# Altium project Anemoia-ESP32-SMD.PrjPcb (part 1 of 3)
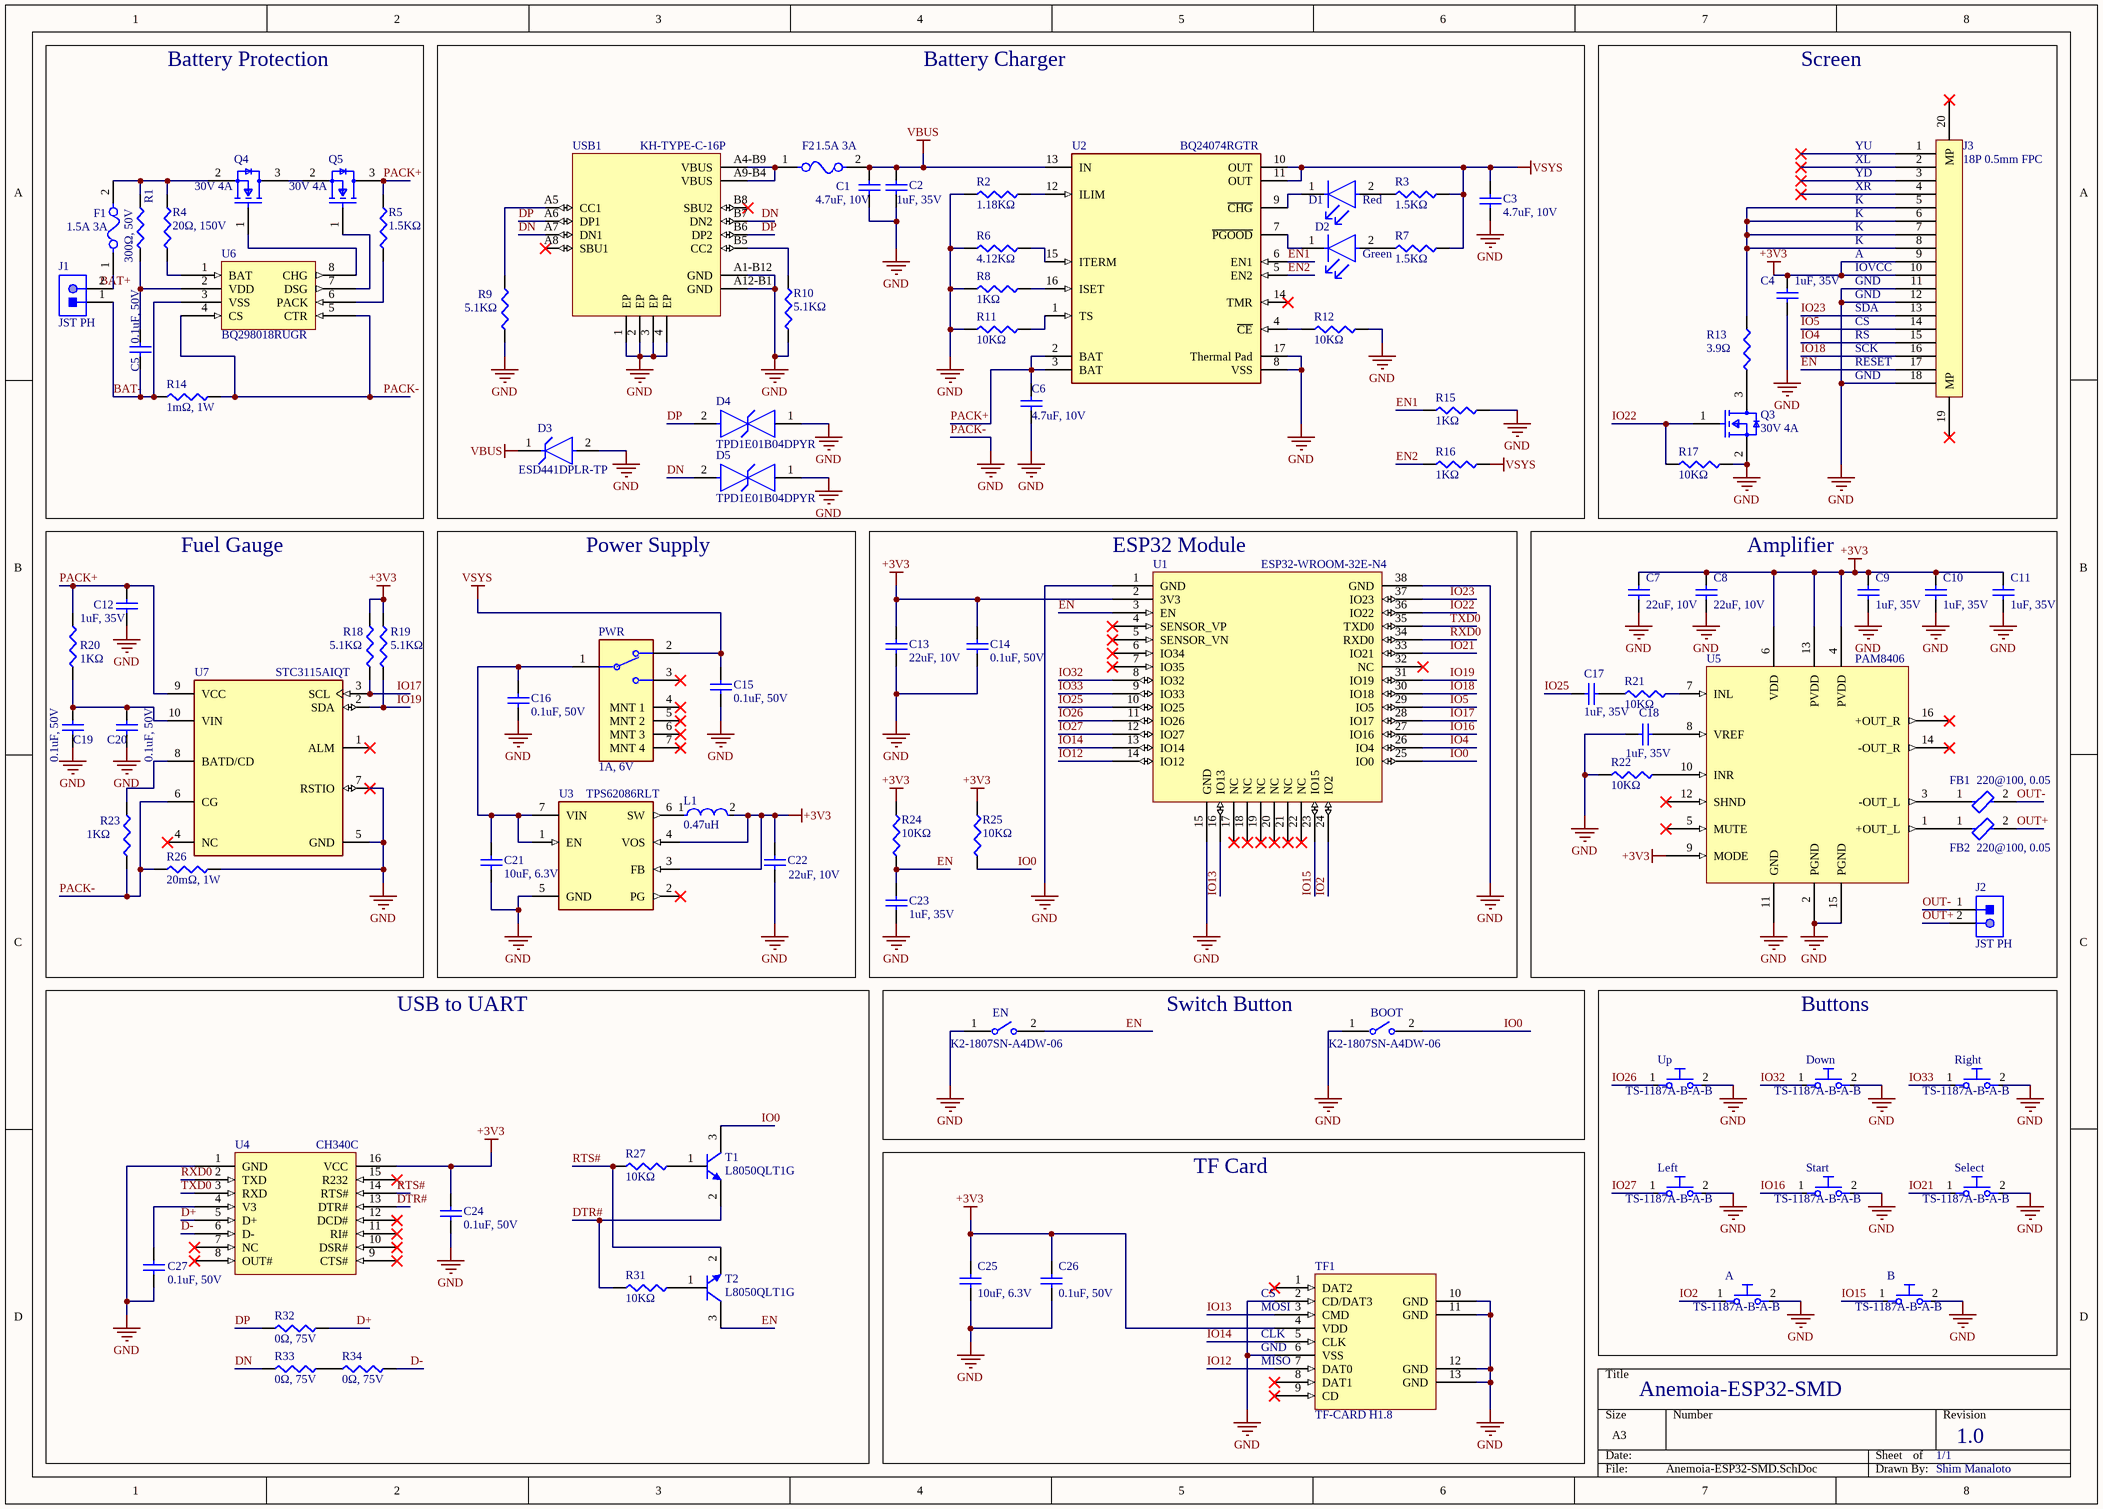
[diagram p0: Anemoia-ESP32-SMD.SchDoc]
1 sheet, 96 parts. Net scope: global (net labels, ports and power ports of the same name join across sheets).
Board file: Anemoia-ESP32-SMD.PcbDoc

## Sheet Anemoia-ESP32-SMD.SchDoc: Anemoia-ESP32
size A3; SheetNumber: 1; SheetTotal: 1

### Parts
A  TS-1187A-B-A-B  [SWITCH TACTILE SMD-4P,5.1x5.1mm]
B  TS-1187A-B-A-B  [SWITCH TACTILE SMD-4P,5.1x5.1mm]
BOOT  K2-1807SN-A4DW-06  [SWITCH TACTILE MD,4x2.9mm]
C1  4.7uF, 10V  [CAP CER 0603]
C2  1uF, 35V  [CAP CER SAMSUNG 0402]
C3  4.7uF, 10V  [CAP CER 0603]
C4  1uF, 35V  [CAP CER SAMSUNG 0402]
C5  0.1uF, 50V  [CAP CER 0603]
C6  4.7uF, 10V  [CAP CER 0603]
C7  22uF, 10V  [CAP CER 0603]
C8  22uF, 10V  [CAP CER 0603]
C9  1uF, 35V  [CAP CER SAMSUNG 0402]
C10  1uF, 35V  [CAP CER SAMSUNG 0402]
C11  1uF, 35V  [CAP CER SAMSUNG 0402]
C12  1uF, 35V  [CAP CER SAMSUNG 0402]
C13  22uF, 10V  [CAP CER 0603]
C14  0.1uF, 50V  [CAP CER 0603]
C15  0.1uF, 50V  [CAP CER 0603]
C16  0.1uF, 50V  [CAP CER 0603]
C17  1uF, 35V  [CAP CER SAMSUNG 0402]
C18  1uF, 35V  [CAP CER SAMSUNG 0402]
C19  0.1uF, 50V  [CAP CER 0603]
C20  0.1uF, 50V  [CAP CER 0603]
C21  10uF, 6.3V  [CAP CER SAMSUNG 0402]
C22  22uF, 10V  [CAP CER 0603]
C23  1uF, 35V  [CAP CER SAMSUNG 0402]
C24  0.1uF, 50V  [CAP CER 0603]
C25  10uF, 6.3V  [CAP CER SAMSUNG 0402]
C26  0.1uF, 50V  [CAP CER 0603]
C27  0.1uF, 50V  [CAP CER 0603]
D1  Red  [Red LED 0603]
D2  Green  [Green LED 0603]
D3  ESD441DPLR-TP  [DFN0603-2]
D4  TPD1E01B04DPYR  [X1-SON-2]
D5  TPD1E01B04DPYR  [X1-SON-2]
Down  TS-1187A-B-A-B  [SWITCH TACTILE SMD-4P,5.1x5.1mm]
EN  K2-1807SN-A4DW-06  [SWITCH TACTILE MD,4x2.9mm]
F1  1.5A 3A  [PTC 1812]
F2  1.5A 3A  [PTC 1812]
FB1  220@100, 0.05  [0603 FB]
FB2  220@100, 0.05  [0603 FB]
J1  JST PH  [JST_S2B-PH-SM4-TB(LF)(SN)]
J2  JST PH  [JST_S2B-PH-SM4-TB(LF)(SN)]
J3  18P 0.5mm FPC  [FPC CN 18P 0.5mm]
L1  0.47uH  [SMD,4x4mm]
Left  TS-1187A-B-A-B  [SWITCH TACTILE SMD-4P,5.1x5.1mm]
PWR  1A, 6V  [MK-12C02-G020]
Q3  30V 4A  [SOT-23]
Q4  30V 4A  [SOT-23]
Q5  30V 4A  [SOT-23]
R1  300Ω, 50V  [RES 0402]
R2  1.18KΩ  [RES 0402]
R3  1.5KΩ  [RES 0603]
R4  20Ω, 150V  [RES 0805]
R5  1.5KΩ  [RES 0603]
R6  4.12KΩ  [RES 0402]
R7  1.5KΩ  [RES 0603]
R8  1KΩ  [RES 0402]
R9  5.1KΩ  [RES 0402]
R10  5.1KΩ  [RES 0402]
R11  10KΩ  [RES 0402]
R12  10KΩ  [RES 0402]
R13  3.9Ω  [RES 0612]
R14  1mΩ, 1W  [RES 1206]
R15  1KΩ  [RES 0402]
R16  1KΩ  [RES 0402]
R17  10KΩ  [RES 0402]
R18  5.1KΩ  [RES 0402]
R19  5.1KΩ  [RES 0402]
R20  1KΩ  [RES 0402]
R21  10KΩ  [RES 0402]
R22  10KΩ  [RES 0402]
R23  1KΩ  [RES 0402]
R24  10KΩ  [RES 0402]
R25  10KΩ  [RES 0402]
R26  20mΩ, 1W  [RES 1206]
R27  10KΩ  [RES 0402]
R31  10KΩ  [RES 0402]
R32  0Ω, 75V  [RES 0OHM]
R33  0Ω, 75V  [RES 0OHM]
R34  0Ω, 75V  [RES 0OHM]
Right  TS-1187A-B-A-B  [SWITCH TACTILE SMD-4P,5.1x5.1mm]
Select  TS-1187A-B-A-B  [SWITCH TACTILE SMD-4P,5.1x5.1mm]
Start  TS-1187A-B-A-B  [SWITCH TACTILE SMD-4P,5.1x5.1mm]
T1  L8050QLT1G  [SOT-23]
T2  L8050QLT1G  [SOT-23]
TF1  TF-CARD H1.8  [TF-CARD H1.8]
U1  ESP32-WROOM-32E-N4  [ESP32-WROOM-32E-N4]
U2  BQ24074RGTR  [BQ24074RGTR]
U3  TPS62086RLT  [VSON-7(2x2)]
U4  CH340C  [SOP-16]
U5  PAM8406  [SOP-16]
U6  BQ298018RUGR  [X2-QFN-8(1.5x1.5)]
U7  STC3115AIQT  [DFN-10(2x3)]
Up  TS-1187A-B-A-B  [SWITCH TACTILE SMD-4P,5.1x5.1mm]
USB1  KH-TYPE-C-16P  [USB-C-SMD_KH-TYPE-C-16P]

### Blocks framed on the sheet
Battery Protection: C5 F1 J1 Q4 Q5 R1 R4 R5 R14 U6
Battery Charger: C1-C3 C6 D1-D5 F2 R2 R3 R6-R12 R15 R16 U2 USB1
Screen: C4 J3 Q3 R13 R17
Fuel Gauge: C12 C19 C20 R18-R20 R23 R26 U7
Power Supply: C15 C16 C21 C22 L1 PWR U3
ESP32 Module: C13 C14 C23 R24 R25 U1
Amplifier: C7-C11 C17 C18 FB1 FB2 J2 R21 R22 U5
USB to UART: C24 C27 R27 R31-R34 T1 T2 U4
Switch Button: BOOT EN
Buttons: A B Down Left Right Select Start Up
TF Card: C25 C26 TF1

### Nets
+3V3: C4.2 C7.2 C8.2 C9.2 C10.2 C11.2 C13.1 C14.2 C22.2 C24.1 C25.2 C26.2 J3.9 J3.10 L1.2 R18.2 R19.2 R24.1 R25.1 TF1.4(VDD) U1.2(3V3) U3.3(FB) U3.4(VOS) U4.16(VCC) U5.4(PVDD) U5.6(VDD) U5.9(MODE) U5.13(PVDD)
PACK-: A.2 B.2 BOOT.1 C1.1 C2.2 C3.1 C4.1 C6.1 C7.1 C8.1 C9.1 C10.1 C11.1 C12.1 C13.2 C14.1 C15.1 C16.1 C18.1 C19.1 C20.1 C21.2 C22.1 C23.2 C24.2 C25.1 C26.1 C27.2 D3.2(GND) D4.1(IO) D5.1(IO) Down.2 EN.1 J3.11 J3.12 J3.18 Left.2 Q3.2(source) R2.2 R6.1 R8.1 R9.1 R10.1 R11.2 R12.2 R14.2 R15.2 R17.1 R22.1 R23.1 R26.1 R26.2 Right.2 Select.2 Start.2 TF1.2(CD/DAT3) TF1.6(VSS) TF1.10(GND) TF1.11(GND) TF1.12(GND) TF1.13(GND) U1.1(GND) U1.15(GND) U1.38(GND) U2.8(VSS) U2.17(Thermal_Pad) U3.5(GND) U4.1(GND) U5.2(PGND) U5.11(GND) U5.15(PGND) U6.4(CS) U6.5(CTR) U7.5(GND) U7.6(CG) U7.7(RSTIO) Up.2 USB1.1(EP) USB1.2(EP) USB1.3(EP) USB1.4(EP) USB1.A1-B12(GND) USB1.A12-B1(GND)  [also labelled GND]
VBUS: C1.2 C2.1 D3.1(IO) F2.2 U2.13(IN)
VSYS: C3.2 C15.2 PWR.2 R3.2 R7.2 R16.2 U2.10(OUT) U2.11(OUT)
BAT-: C5.1 J1.1 R14.1 U6.3(VSS)
D+: R32.2 U4.5(D+)
D-: R34.2 U4.6(D-)
DN: D5.2(GND) R33.1 USB1.A7(DN1) USB1.B7(DN2)
DP: D4.2(GND) R32.1 USB1.A6(DP1) USB1.B6(DP2)
DTR#: R31.1 T1.2(E) U4.13(DTR#)
EN: C23.1 EN.2 J3.17 R24.2 T2.3(C) U1.3(EN)
EN1: R15.1 U2.6(EN1)
EN2: R16.1 U2.5(EN2)
IO0: BOOT.2 R25.2 T1.3(C) U1.25(IO0)
IO2: A.1 U1.24(IO2)
IO4: J3.15 U1.26(IO4)
IO5: J3.14 U1.29(IO5)
IO12: TF1.7(DAT0) U1.14(IO12)
IO13: TF1.3(CMD) U1.16(IO13)
IO14: TF1.5(CLK) U1.13(IO14)
IO15: B.1 U1.23(IO15)
IO16: Start.1 U1.27(IO16)
IO17: R18.1 U1.28(IO17) U7.3(SCL)
IO18: J3.16 U1.30(IO18)
IO19: R19.1 U1.31(IO19) U7.2(SDA)
IO21: Select.1 U1.33(IO21)
IO22: Q3.1(gate) R17.2 U1.36(IO22)
IO23: J3.13 U1.37(IO23)
IO25: C17.2 U1.10(IO25)
IO26: U1.11(IO26) Up.1
IO27: Left.1 U1.12(IO27)
IO32: Down.1 U1.8(IO32)
IO33: Right.1 U1.9(IO33)
OUT+: FB2.2 J2.2
OUT-: FB1.2 J2.1
PACK+: C6.2 C12.2 Q5.3(drain) R5.2 R20.2 U2.2(BAT) U2.3(BAT) U7.9(VCC)
RTS#: R27.1 T2.2(E) U4.14(RTS#)
RXD0: U1.34(RXD0) U4.2(TXD)
TXD0: U1.35(TXD0) U4.3(RXD)
NetC5_2: C5.2 R1.1 U6.2(VDD)
NetC16_2: C16.2 C21.1 PWR.1 U3.1(EN) U3.7(VIN)
NetC17_1: C17.1 R21.1
NetC18_2: C18.2 U5.8(VREF)
NetC19_2: C19.2 C20.2 R20.1 U7.10(VIN)
NetC27_1: C27.1 U4.4(V3)
NetD1_1: D1.1(C) U2.9(~{CHG})
NetD1_2: D1.2(A) R3.1
NetD2_1: D2.1(C) U2.7(~{PGOOD})
NetD2_2: D2.2(A) R7.1
NetF1_1: F1.1 J1.2
NetF1_2: F1.2 Q4.2(source) R1.2 R4.2
NetF2_1: F2.1 USB1.A4-B9(VBUS) USB1.A9-B4(VBUS)
NetFB1_1: FB1.1 U5.3(-OUT_L)
NetFB2_1: FB2.1 U5.1(+OUT_L)
NetJ3_5: J3.5 J3.6 J3.7 J3.8 R13.1
NetL1_1: L1.1 U3.6(SW)
NetQ3_3: Q3.3(drain) R13.2
NetQ4_1: Q4.1(gate) U6.8(CHG)
NetQ4_3: Q4.3(drain) Q5.2(source)
NetQ5_1: Q5.1(gate) U6.7(DSG)
NetR2_1: R2.1 U2.12(ILIM)
NetR4_1: R4.1 U6.1(BAT)
NetR5_1: R5.1 U6.6(PACK)
NetR6_2: R6.2 U2.15(ITERM)
NetR8_2: R8.2 U2.16(ISET)
NetR9_2: R9.2 USB1.A5(CC1)
NetR10_2: R10.2 USB1.B5(CC2)
NetR11_1: R11.1 U2.1(TS)
NetR12_1: R12.1 U2.4(~{CE})
NetR21_2: R21.2 U5.7(INL)
NetR22_2: R22.2 U5.10(INR)
NetR23_2: R23.2 U7.8(BATD/CD)
NetR27_2: R27.2 T1.1(B)
NetR31_2: R31.2 T2.1(B)
NetR33_2: R33.2 R34.1

Not connected (* = marked no-connect by the designer): J3 1* 2* 3* 4* 19(MP)* 20(MP)*; PWR 3* 4(MNT_1)* 5(MNT_2)* 6(MNT_3)* 7(MNT_4)*; TF1 1(DAT2)* 8(DAT1)* 9(CD)*; U1 4(SENSOR_VP)* 5(SENSOR_VN)* 6(IO34)* 7(IO35)* 17(NC)* 18(NC)* 19(NC)* 20(NC)* 21(NC)* 22(NC)* 32(NC)*; U2 14(TMR)*; U3 2(PG)*; U4 7(NC)* 8(OUT#)* 9(CTS#)* 10(DSR#)* 11(RI#)* 12(DCD#)* 15(R232)*; U5 5(MUTE)* 12(SHND)* 14(-OUT_R)* 16(+OUT_R)*; U7 1(ALM)* 4(NC)*; USB1 A8(SBU1)* B8(SBU2)*

### Notes on the sheet
- YD
- XL
- YU
- K
- XR
- SDA
- GND
- IOVCC
- A
- (near J3) RESET
- SCK
- RS
- CS
- (near TF1) MOSI
- (near TF1) CS
- (near TF1) MISO
- (near TF1) GND
- (near TF1) CLK
- Anemoia-ESP32-SMD
- 1/1
- 1.0
- Shim Manaloto
- Labels drawn without touching a wire or pin: BAT+